# Altium schematic sheet GPIOs.SchDoc: Apalis Evaluation Board 1.1
size A3; Organization: Toradex AG; Address1: Altsagenstrasse 5; Address2: Horw; Address3: 6048; Address4: Switzerland; DocumentNumber: 10; Revision: V1.1; SheetNumber: 10; SheetTotal: 32; PageSetup: Record=PageOptions|CenterHorizontal=True|CenterVertical=True|PrintScale=0.73|XCorrection=1.00|YCorrection=1.00|PrintKind=0|BorderSize=5000000|LeftOffset=0|BottomOffset=0|Orientation=2|PaperLength=1000|PaperWidth=1000|Scale=100|PaperSource=7|PrintQuality=-4|MediaType=1|DitherType=10|PaperKind=A4|PrintScaleMode=1
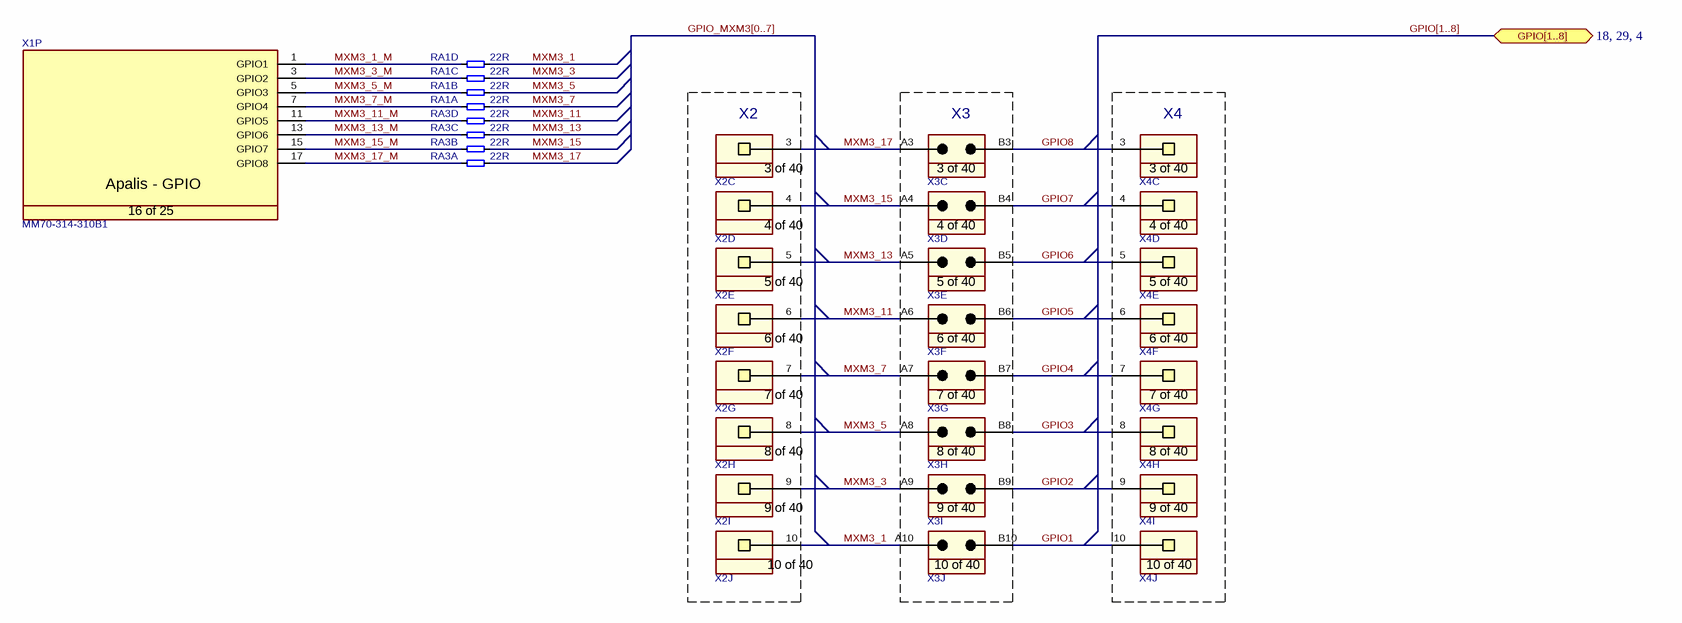
[diagram p0: GPIOs.SchDoc]

## Parts
RA1  22R  [T_Resistor_Array_X4]  (parts A,B,C,D of 4)
RA3  22R  [T_Resistor_Array_X4]  (parts A,B,C,D of 4)
X1  Manufacturer Part No.: MM70-314-310B1  [T_JAE_MM70-314-310B1]  (hidden comment: CON-JAE-MM70-314-310B1-314-0.5mm)  (part P of 25)
X2  SSW-110-01-G-S  [T_Samtec_SSW-110-01-G-S]  (value not drawn)  (parts C,D,E,F,G,H,I,J of 40)
X3  TSW-110-07-G-D  [T_Samtec_TSW-110-07-G-D]  (value not drawn)  (parts C,D,E,F,G,H,I,J of 40)
X4  SSW-110-01-G-S  [T_Samtec_SSW-110-01-G-S]  (value not drawn)  (parts C,D,E,F,G,H,I,J of 40)

## Blocks framed on the sheet
X2: X2
X3: X3
X4: X4

## Ports
GPIO[1..8] (bidir, see 18, 29, 4)

## Nets
GPIO1: X3.B10 X4.10
GPIO2: X3.B9 X4.9
GPIO3: X3.B8 X4.8
GPIO4: X3.B7 X4.7
GPIO5: X3.B6 X4.6
GPIO6: X3.B5 X4.5
GPIO7: X3.B4 X4.4
GPIO8: X3.B3 X4.3
MXM3_1: RA1.8 X2.10 X3.A10
MXM3_1_M: RA1.4 X1.1(GPIO1)
MXM3_3: RA1.7 X2.9 X3.A9
MXM3_3_M: RA1.3 X1.3(GPIO2)
MXM3_5: RA1.6 X2.8 X3.A8
MXM3_5_M: RA1.2 X1.5(GPIO3)
MXM3_7: RA1.5 X2.7 X3.A7
MXM3_7_M: RA1.1 X1.7(GPIO4)
MXM3_11: RA3.8 X2.6 X3.A6
MXM3_11_M: RA3.4 X1.11(GPIO5)
MXM3_13: RA3.7 X2.5 X3.A5
MXM3_13_M: RA3.3 X1.13(GPIO6)
MXM3_15: RA3.6 X2.4 X3.A4
MXM3_15_M: RA3.2 X1.15(GPIO7)
MXM3_17: RA3.5 X2.3 X3.A3
MXM3_17_M: RA3.1 X1.17(GPIO8)

## Buses and harness runs
bus GPIO[1..8] = port GPIO[1..8]
bus GPIO_MXM3[0..7]

## Notes on the sheet
- Title
- Size:
- Date:
- A3
- Number:
- Time:
- Revision:
- Sheet
- of
- File:
- (in symbol CON-JAE-MM70-314-310B1-314-0.5mm, part P) Apalis - GPIO; 16 of 25
- (in symbol CON-Samtec-SSW-110-01-G-S, part C) 3 of 40
- (in symbol CON-Samtec-SSW-110-01-G-S, part D) 4 of 40
- (in symbol CON-Samtec-SSW-110-01-G-S, part E) 5 of 40
- (in symbol CON-Samtec-SSW-110-01-G-S, part F) 6 of 40
- (in symbol CON-Samtec-SSW-110-01-G-S, part G) 7 of 40
- (in symbol CON-Samtec-SSW-110-01-G-S, part H) 8 of 40
- (in symbol CON-Samtec-SSW-110-01-G-S, part I) 9 of 40
- (in symbol CON-Samtec-SSW-110-01-G-S, part J) 10 of 40
- (in symbol CON-Samtec-TSW-110-07-G-D, part C) 3 of 40
- (in symbol CON-Samtec-TSW-110-07-G-D, part D) 4 of 40
- (in symbol CON-Samtec-TSW-110-07-G-D, part E) 5 of 40
- (in symbol CON-Samtec-TSW-110-07-G-D, part F) 6 of 40
- (in symbol CON-Samtec-TSW-110-07-G-D, part G) 7 of 40
- (in symbol CON-Samtec-TSW-110-07-G-D, part H) 8 of 40
- (in symbol CON-Samtec-TSW-110-07-G-D, part I) 9 of 40
- (in symbol CON-Samtec-TSW-110-07-G-D, part J) 10 of 40

## Library data of the parts
RA1 RA3 = RA-22R-63mW-5%-1206-div: Resistor Array 22 R 63mW 5% 1206; Tolerance: 5%; Power Dissipation: 63mW; Value: 22R
X1 = CON-JAE-MM70-314-310B1-314-0.5mm: MXM3 Connector; Manufacturer Name: JAE; No. of ways: 314
X2 X4 = CON-Samtec-SSW-110-01-G-S: Receptacle Female Socket 1x40 pin 2.54mm pitch; Manufacturer Name: Samtec; Pitch: 2.54mm; No. of ways: 1x40; Manufacturer Part No.: SSW-110-01-G-S
X3 = CON-Samtec-TSW-110-07-G-D: Header 2x40 pin 2.54mm pitch; Manufacturer Name: Samtec; Pitch: 2.54mm; No. of ways: 2x40; Manufacturer Part No.: TSW-110-07-G-D